# EAGLE design Nodo_actuador_wa4_v1 (EAGLE 8.5.1)

## Sheet 1 of 4: FUENTES
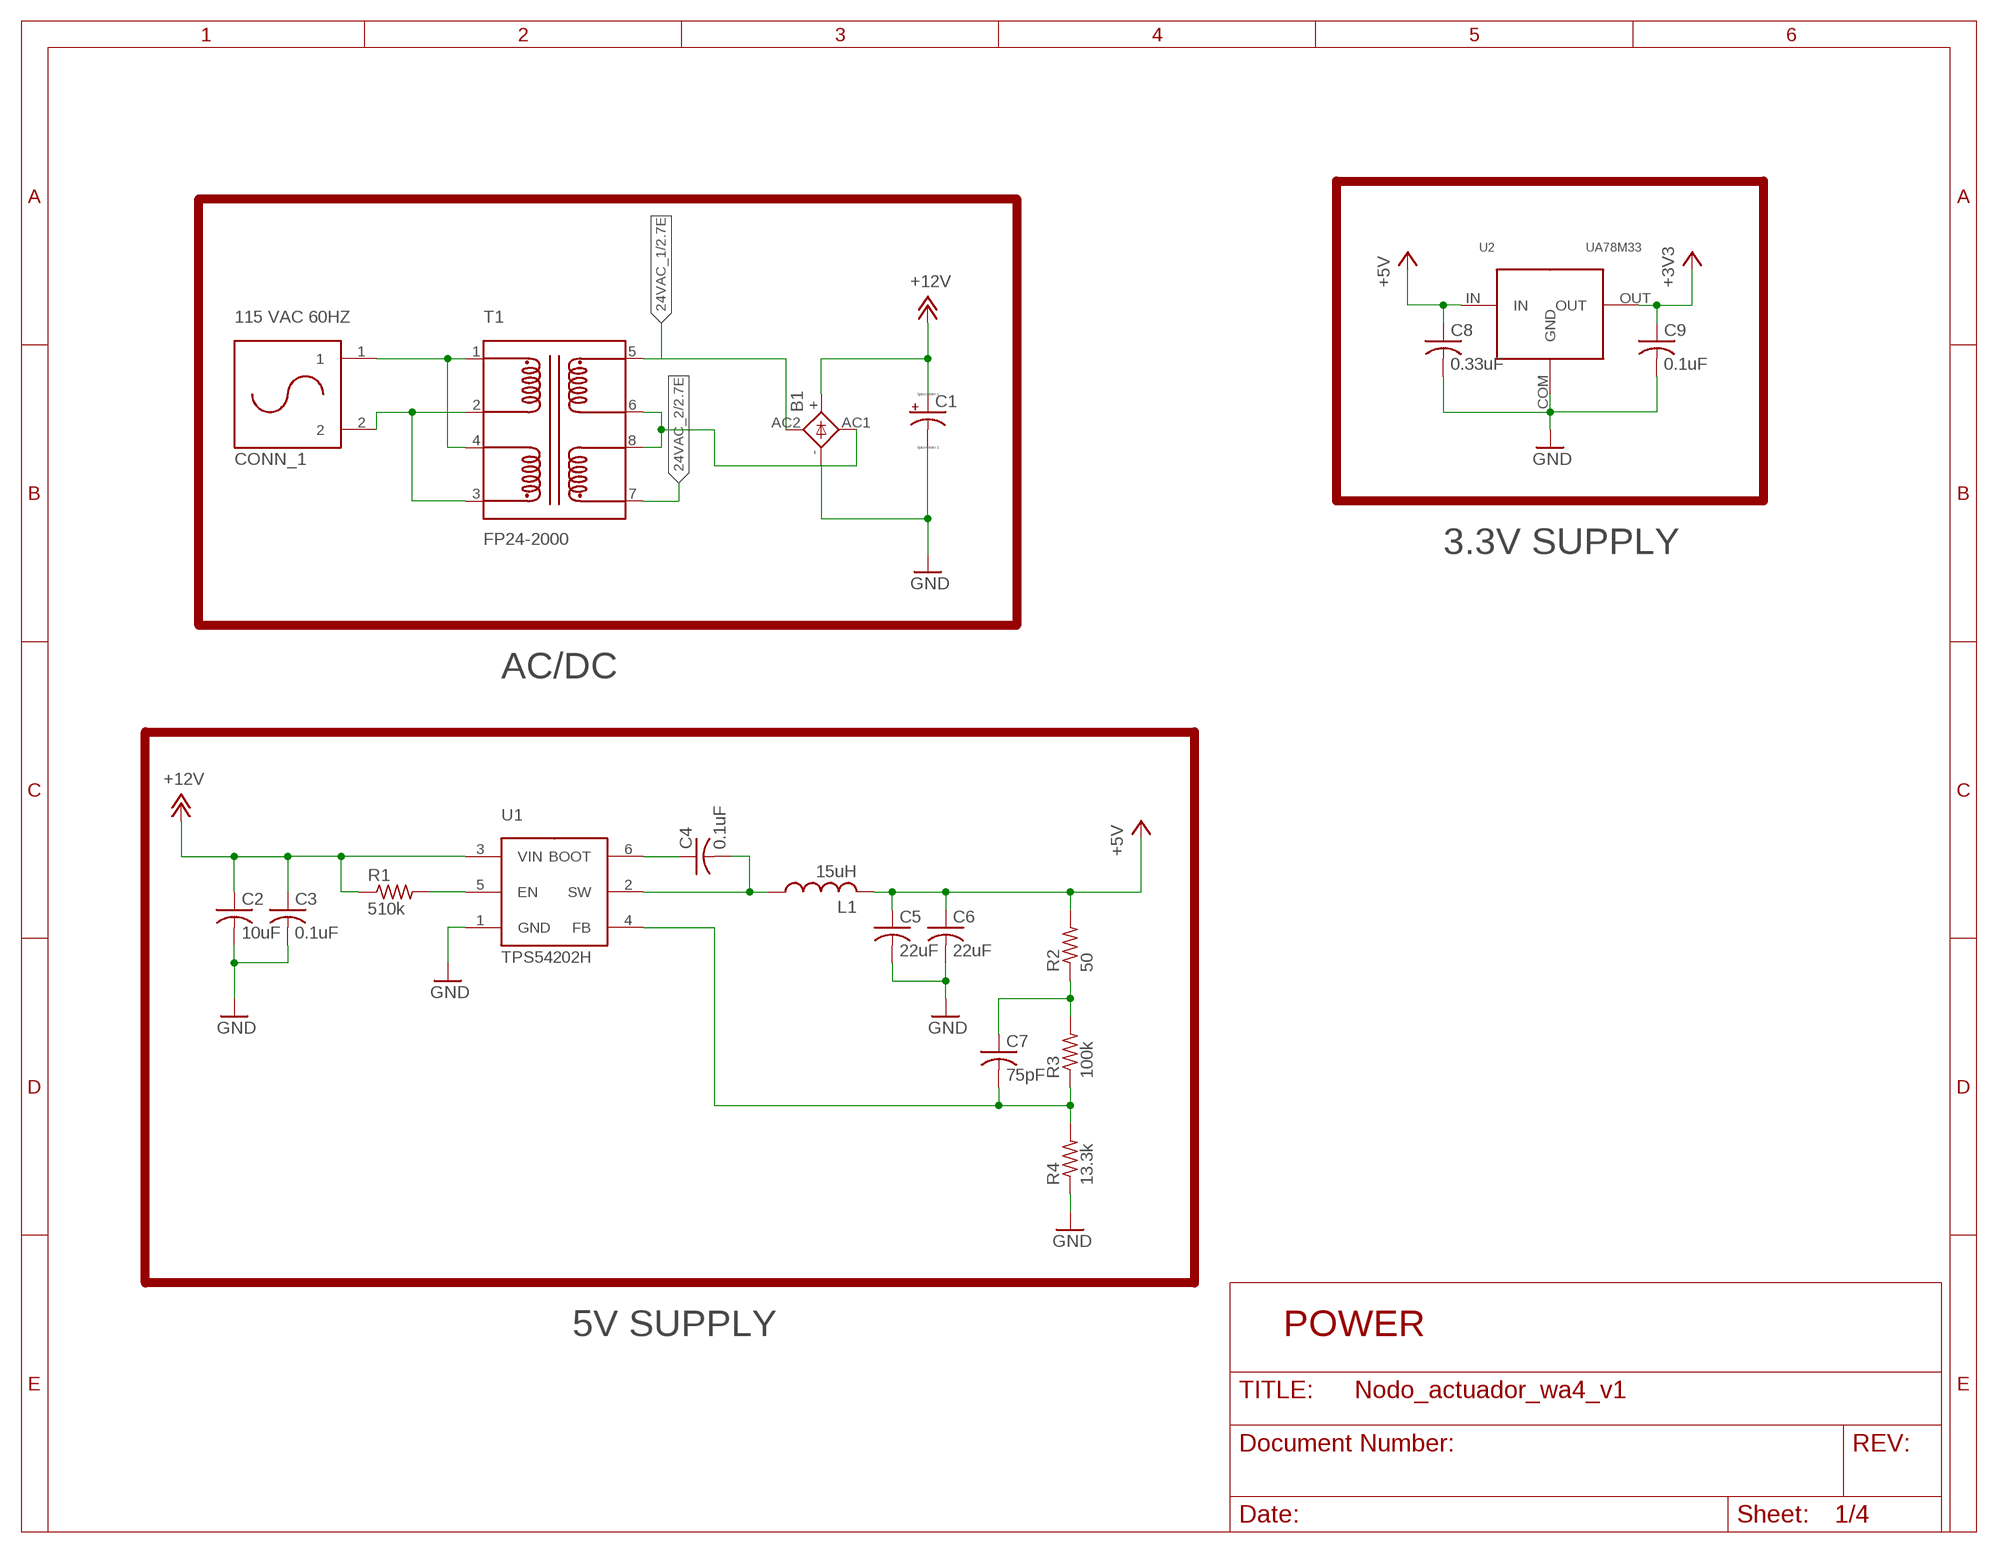
[diagram p0: schematic, sheet 1]

### Parts
B1  GBU4  [GBU4S]
C1  CPOL-USE5-13  [E5-13]
C2  10uF  C-USC0805  [C0805]
C3  0.1uF  C-USC0805  [C0805]
C4  0.1uF  C-USC0805  [C0805]
C5  22uF  C-USC0805  [C0805]
C6  22uF  C-USC0805  [C0805]
C7  75pF  C-USC0805  [C0805]
C8  0.33uF  C-USC0805  [C0805]
C9  0.1uF  C-USC0805  [C0805]
CONN_1  115 VAC 60HZ  2570-2210  [2570-2210]
L1  15uH  VLS5045EX  [VLS5045]
R1  510k  R-US_R0805  [R0805]
R2  50  R-US_R0805  [R0805]
R3  100k  R-US_R0805  [R0805]
R4  13.3k  R-US_R0805  [R0805]
T1  FP24-2000  [FP24-2000]
U1  TPS54202H  [SOT-23-6]
U2  UA78M33  [UA78XX]

### Nets
24VAC_1: B1.AC2(AC1) T1.5 ; also sheet 2
24VAC_2: T1.7 ; also sheet 2
+3V3: C9.1 U2.OUT ; also sheet 2,3,4
+5V: C5.1 C6.1 C8.1 L1.2 R2.2 U2.IN ; also sheet 2,3
+12V: B1.+ C1.+ C2.1 C3.1 R1.1 U1.3(VIN) ; also sheet 4
GND: B1.- C1.- C2.2 C3.2 C5.2 C6.2 C8.2 C9.2 R4.1 U1.1(GND) U2.COM(GND) ; also sheet 2,3,4
N$1: CONN_1.1 T1.1 T1.4
N$2: CONN_1.2 T1.2 T1.3
N$3: B1.AC1(AC2) T1.6 T1.8
N$4: C4.1 U1.6(BOOT)
N$5: C4.2 L1.1 U1.2(SW)
N$6: R1.2 U1.5(EN)
N$8: C7.1 R2.1 R3.2
N$9: C7.2 R3.1 R4.2 U1.4(FB)

### Notes on the sheet
- 3.3V SUPPLY
- AC/DC
- 5V SUPPLY | POWER

## Sheet 2 of 4: VALVULAS Y BOTONERA
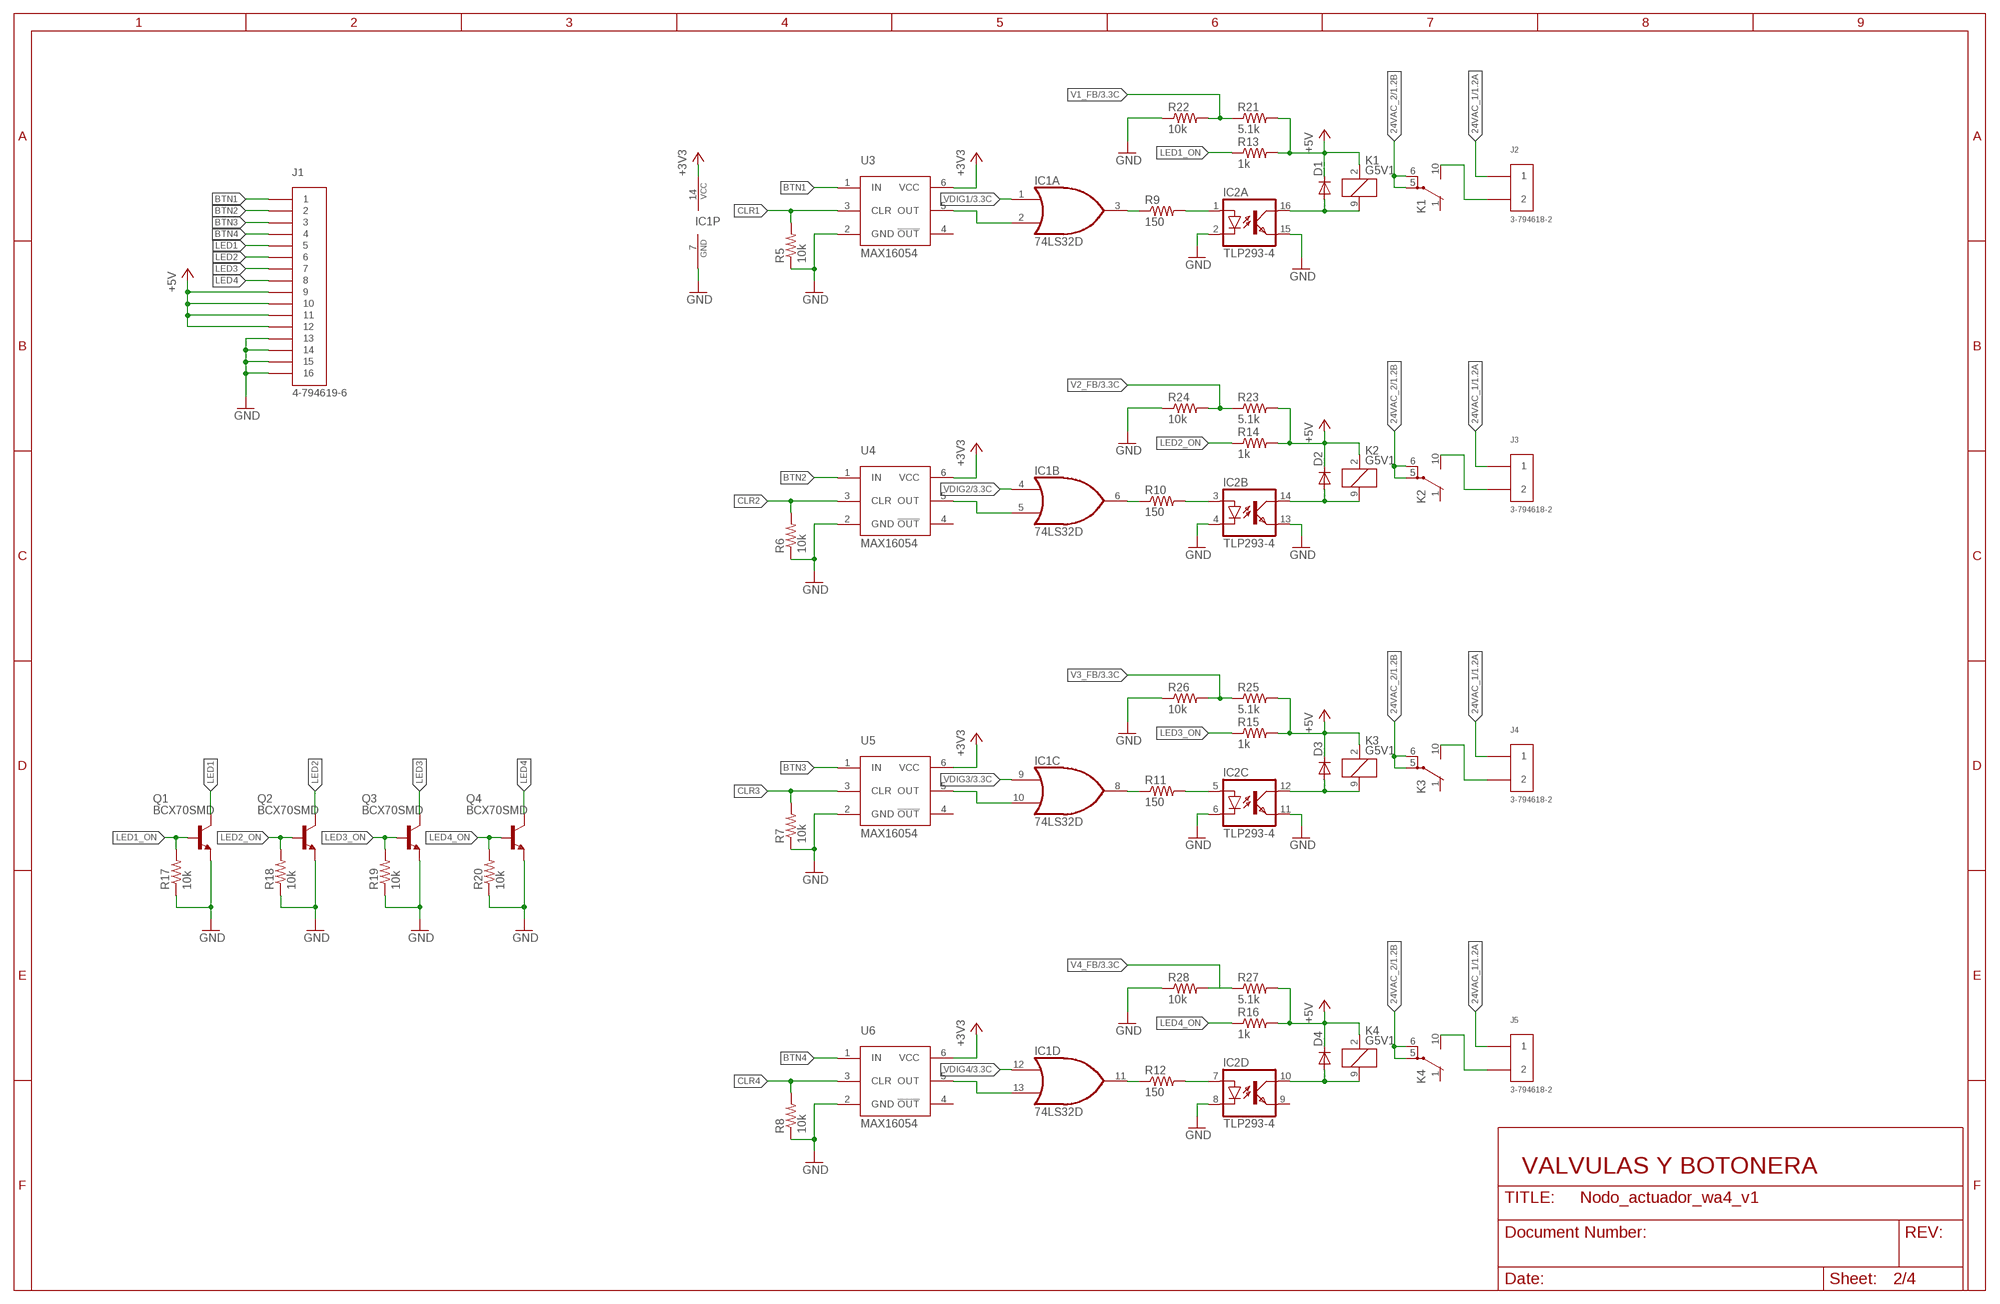
[diagram p1: schematic, sheet 2]

### Parts
D1  MBR0520LT  [SOD123]
D2  MBR0520LT  [SOD123]
D3  MBR0520LT  [SOD123]
D4  MBR0520LT  [SOD123]
IC1  74LS32D  [SO14]
IC2  TLP293-4  [SO16]
J1  4-794619-6  [4-794619-6]
J2  3-794618-2  [3-794618-2]
J3  3-794618-2  [3-794618-2]
J4  3-794618-2  [3-794618-2]
J5  3-794618-2  [3-794618-2]
K1  G5V1  [G5V1]
K2  G5V1  [G5V1]
K3  G5V1  [G5V1]
K4  G5V1  [G5V1]
Q1  BCX70SMD  [SOT23]
Q2  BCX70SMD  [SOT23]
Q3  BCX70SMD  [SOT23]
Q4  BCX70SMD  [SOT23]
R5  10k  R-US_R0805  [R0805]
R6  10k  R-US_R0805  [R0805]
R7  10k  R-US_R0805  [R0805]
R8  10k  R-US_R0805  [R0805]
R9  150  R-US_R0805  [R0805]
R10  150  R-US_R0805  [R0805]
R11  150  R-US_R0805  [R0805]
R12  150  R-US_R0805  [R0805]
R13  1k  R-US_R0805  [R0805]
R14  1k  R-US_R0805  [R0805]
R15  1k  R-US_R0805  [R0805]
R16  1k  R-US_R0805  [R0805]
R17  10k  R-US_R0805  [R0805]
R18  10k  R-US_R0805  [R0805]
R19  10k  R-US_R0805  [R0805]
R20  10k  R-US_R0805  [R0805]
R21  5.1k  R-US_R0805  [R0805]
R22  10k  R-US_R0805  [R0805]
R23  5.1k  R-US_R0805  [R0805]
R24  10k  R-US_R0805  [R0805]
R25  5.1k  R-US_R0805  [R0805]
R26  10k  R-US_R0805  [R0805]
R27  5.1k  R-US_R0805  [R0805]
R28  10k  R-US_R0805  [R0805]
U3  MAX16054  [SOT-23-6]
U4  MAX16054  [SOT-23-6]
U5  MAX16054  [SOT-23-6]
U6  MAX16054  [SOT-23-6]

### Nets
24VAC_1: J2.1 J3.1 J4.1 J5.1 ; also sheet 1
24VAC_2: K1.5(2:P) K1.6(2:P) K2.5(2:P) K2.6(2:P) K3.5(2:P) K3.6(2:P) K4.5(2:P) K4.6(2:P) ; also sheet 1
+3V3: IC1.14(P:VCC) U3.6(VCC) U4.6(VCC) U5.6(VCC) U6.6(VCC) ; also sheet 1,3,4
+5V: D1.C D2.C D3.C D4.C J1.5 J1.6 J1.7 J1.8 K1.2 K2.2 K3.2 K4.2 R13.2 R14.2 R15.2 R16.2 R21.2 R23.2 R25.2 R27.2 ; also sheet 1,3
BTN1: J1.16 U3.1(IN)
BTN2: J1.15 U4.1(IN)
BTN3: J1.14 U5.1(IN)
BTN4: J1.13 U6.1(IN)
CLR1: R5.2 U3.3(CLR)
CLR2: R6.2 U4.3(CLR)
CLR3: R7.2 U5.3(CLR)
CLR4: R8.2 U6.3(CLR)
GND: IC1.7(P:GND) IC2.2(A:C) IC2.4(B:C) IC2.6(C:C) IC2.8(D:C) IC2.11(C:EMIT) IC2.13(B:EMIT) IC2.15(A:EMIT) J1.1 J1.2 J1.3 J1.4 Q1.2(E) Q2.2(E) Q3.2(E) Q4.2(E) R5.1 R6.1 R7.1 R8.1 R17.1 R18.1 R19.1 R20.1 R22.1 R24.1 R26.1 R28.1 U3.2(GND) U4.2(GND) U5.2(GND) U6.2(GND) ; also sheet 1,3,4
LED1: D1.A IC2.16(A:COL) J1.12 K1.9 Q1.3(C)
LED1_ON: Q1.1(B) R13.1 R17.2 ; also sheet 3
LED2: J1.11 Q2.3(C)
LED2_ON: Q2.1(B) R14.1 R18.2
LED3: J1.10 Q3.3(C)
LED3_ON: Q3.1(B) R15.1 R19.2
LED4: J1.9 Q4.3(C)
LED4_ON: Q4.1(B) R16.1 R20.2
N$7: IC1.2(A:I1) U3.5(OUT)
N$10: IC1.5(B:I1) U4.5(OUT)
N$11: IC1.10(C:I1) U5.5(OUT)
N$12: IC1.13(D:I1) U6.5(OUT)
N$13: IC1.3(A:O) R9.1
N$14: IC2.1(A:A) R9.2
N$15: IC1.6(B:O) R10.1
N$16: IC1.8(C:O) R11.1
N$17: IC1.11(D:O) R12.1
N$18: IC2.7(D:A) R12.2
N$19: IC2.5(C:A) R11.2
N$20: IC2.3(B:A) R10.2
N$21: D3.A IC2.12(C:COL) K3.9
N$22: D4.A IC2.10(D:COL) K4.9
N$23: D2.A IC2.14(B:COL) K2.9
N$24: J2.2 K1.10(2:S)
N$25: J3.2 K2.10(2:S)
N$26: J4.2 K3.10(2:S)
N$27: J5.2 K4.10(2:S)
V1_FB: R21.1 R22.2 ; also sheet 3
V2_FB: R23.1 R24.2 ; also sheet 3
V3_FB: R25.1 R26.2 ; also sheet 3
V4_FB: R27.1 R28.2 ; also sheet 3
VDIG1: IC1.1(A:I0) ; also sheet 3
VDIG2: IC1.4(B:I0) ; also sheet 3
VDIG3: IC1.9(C:I0) ; also sheet 3
VDIG4: IC1.12(D:I0) ; also sheet 3
Unconnected: IC2.9(D:EMIT) K1.1(2:O) K2.1(2:O) K3.1(2:O) K4.1(2:O) U3.4(!OUT) U4.4(!OUT) U5.4(!OUT) U6.4(!OUT)

### Notes on the sheet
- VALVULAS Y BOTONERA

## Sheet 3 of 4: ARDUINO Y COMUNICACION
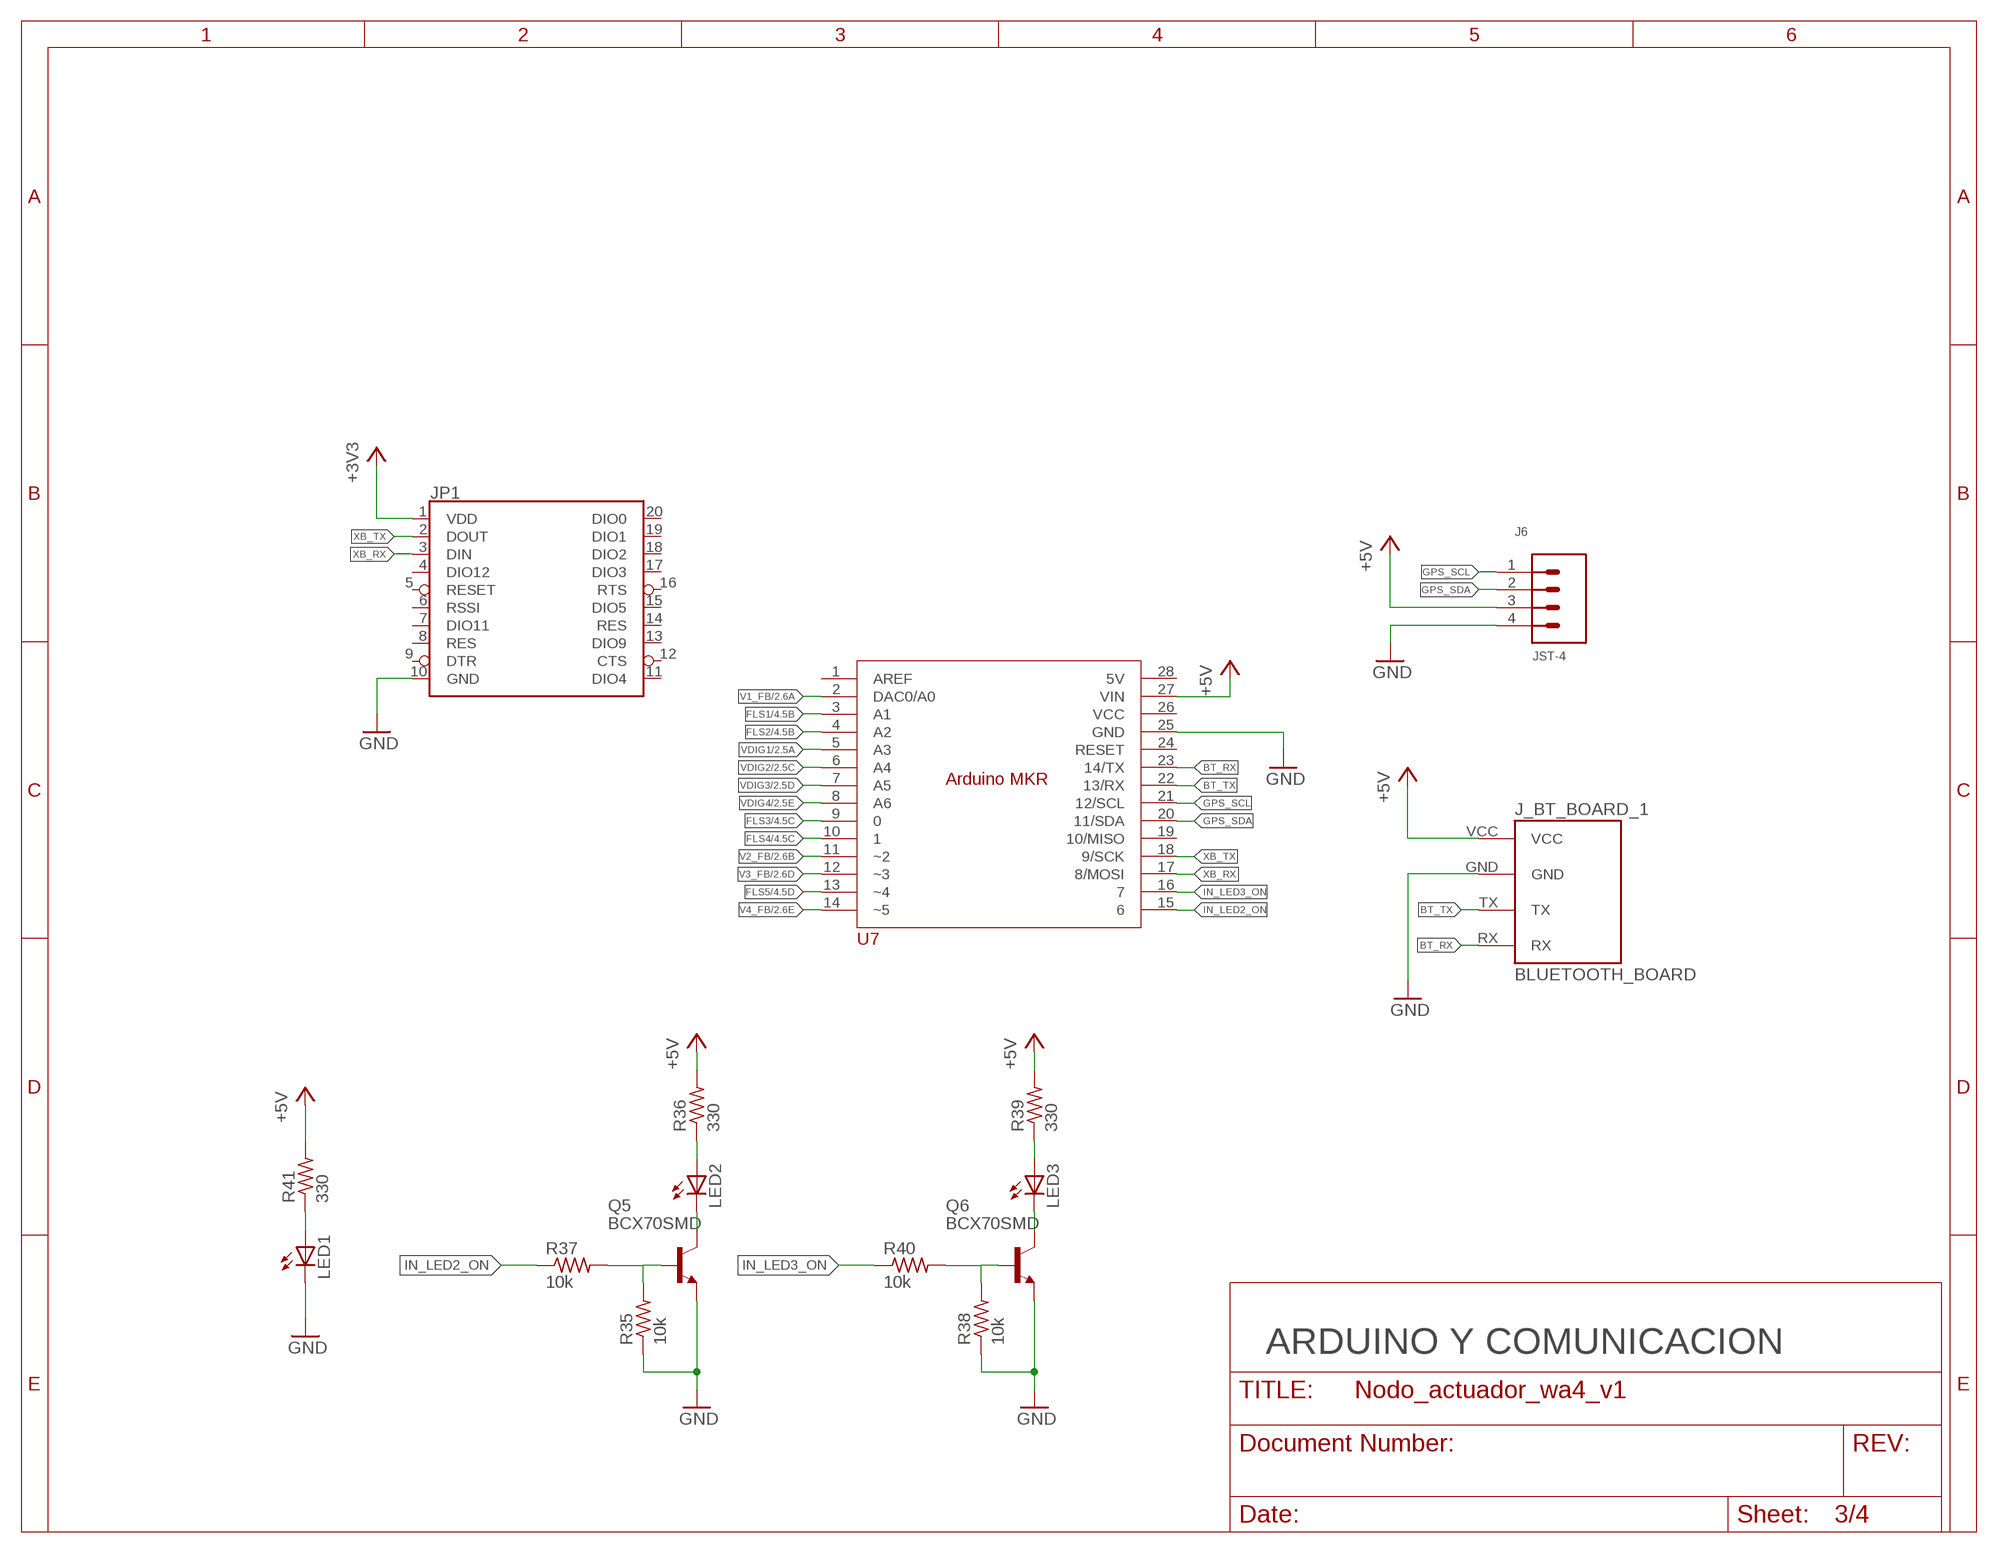
[diagram p2: schematic, sheet 3]

### Parts
J6  JST-4  [JST-4]
J_BT_BOARD_1  BLUETOOTH_BOARD  [BT_BOARD_FOOTPRINT]
JP1  XBEESILK  [XBEE-SILK]
LED1  LEDCHIP-LED0805  [CHIP-LED0805]
LED2  LEDCHIP-LED0805  [CHIP-LED0805]
LED3  LEDCHIP-LED0805  [CHIP-LED0805]
Q5  BCX70SMD  [SOT23]
Q6  BCX70SMD  [SOT23]
R35  10k  R-US_R0805  [R0805]
R36  330  R-US_R0805  [R0805]
R37  10k  R-US_R0805  [R0805]
R38  10k  R-US_R0805  [R0805]
R39  330  R-US_R0805  [R0805]
R40  10k  R-US_R0805  [R0805]
R41  330  R-US_R0805  [R0805]
U7  ARDUINO_MKR  [ARDUINO_MKR]

### Nets
+3V3: JP1.1(VDD) ; also sheet 1,2,4
+5V: J6.3 J_BT_BOARD_1.VCC R36.2 R39.2 R41.2 U7.27(VIN) ; also sheet 1,2
BT_RX: J_BT_BOARD_1.RX U7.23(14/TX)
BT_TX: J_BT_BOARD_1.TX U7.22(13/RX)
FLS1: U7.3(A1) ; also sheet 4
FLS2: U7.4(A2) ; also sheet 4
FLS3: U7.9 ; also sheet 4
FLS4: U7.10 ; also sheet 4
FLS5: U7.13(~4) ; also sheet 4
GND: J6.4 J_BT_BOARD_1.GND JP1.10(GND) LED1.C Q5.2(E) Q6.2(E) R35.1 R38.1 U7.25(GND) ; also sheet 1,2,4
GPS_SCL: J6.1 U7.21(12/SCL)
GPS_SDA: J6.2 U7.20(11/SDA)
IN_LED2_ON: R37.1 U7.15
IN_LED3_ON: R40.1 U7.16
LED1_ON: Q5.1(B) R35.2 R37.2 ; also sheet 2
LED1_ON1: Q6.1(B) R38.2 R40.2
N$38: LED2.A R36.1
N$39: LED2.C Q5.3(C)
N$40: LED1.A R41.1
N$41: LED3.A R39.1
N$42: LED3.C Q6.3(C)
V1_FB: U7.2(DAC0/A0) ; also sheet 2
V2_FB: U7.11(~2) ; also sheet 2
V3_FB: U7.12(~3) ; also sheet 2
V4_FB: U7.14(~5) ; also sheet 2
VDIG1: U7.5(A3) ; also sheet 2
VDIG2: U7.6(A4) ; also sheet 2
VDIG3: U7.7(A5) ; also sheet 2
VDIG4: U7.8(A6) ; also sheet 2
XB_RX: JP1.3(DIN) U7.17(8/MOSI)
XB_TX: JP1.2(DOUT) U7.18(9/SCK)
Unconnected: JP1.4(DIO12) JP1.5(RESET) JP1.6(RSSI) JP1.7(DIO11) JP1.8(RES) JP1.9(DTR) JP1.11(DIO4) JP1.12(CTS) JP1.13(DIO9) JP1.14(RES) JP1.15(DIO5) JP1.16(RTS) JP1.17(DIO3) JP1.18(DIO2) JP1.19(DIO1) JP1.20(DIO0) U7.1(AREF) U7.19(10/MISO) U7.24(RESET) U7.26(VCC) U7.28(5V)

### Notes on the sheet
- ARDUINO Y COMUNICACION

## Sheet 4 of 4: SENSORES
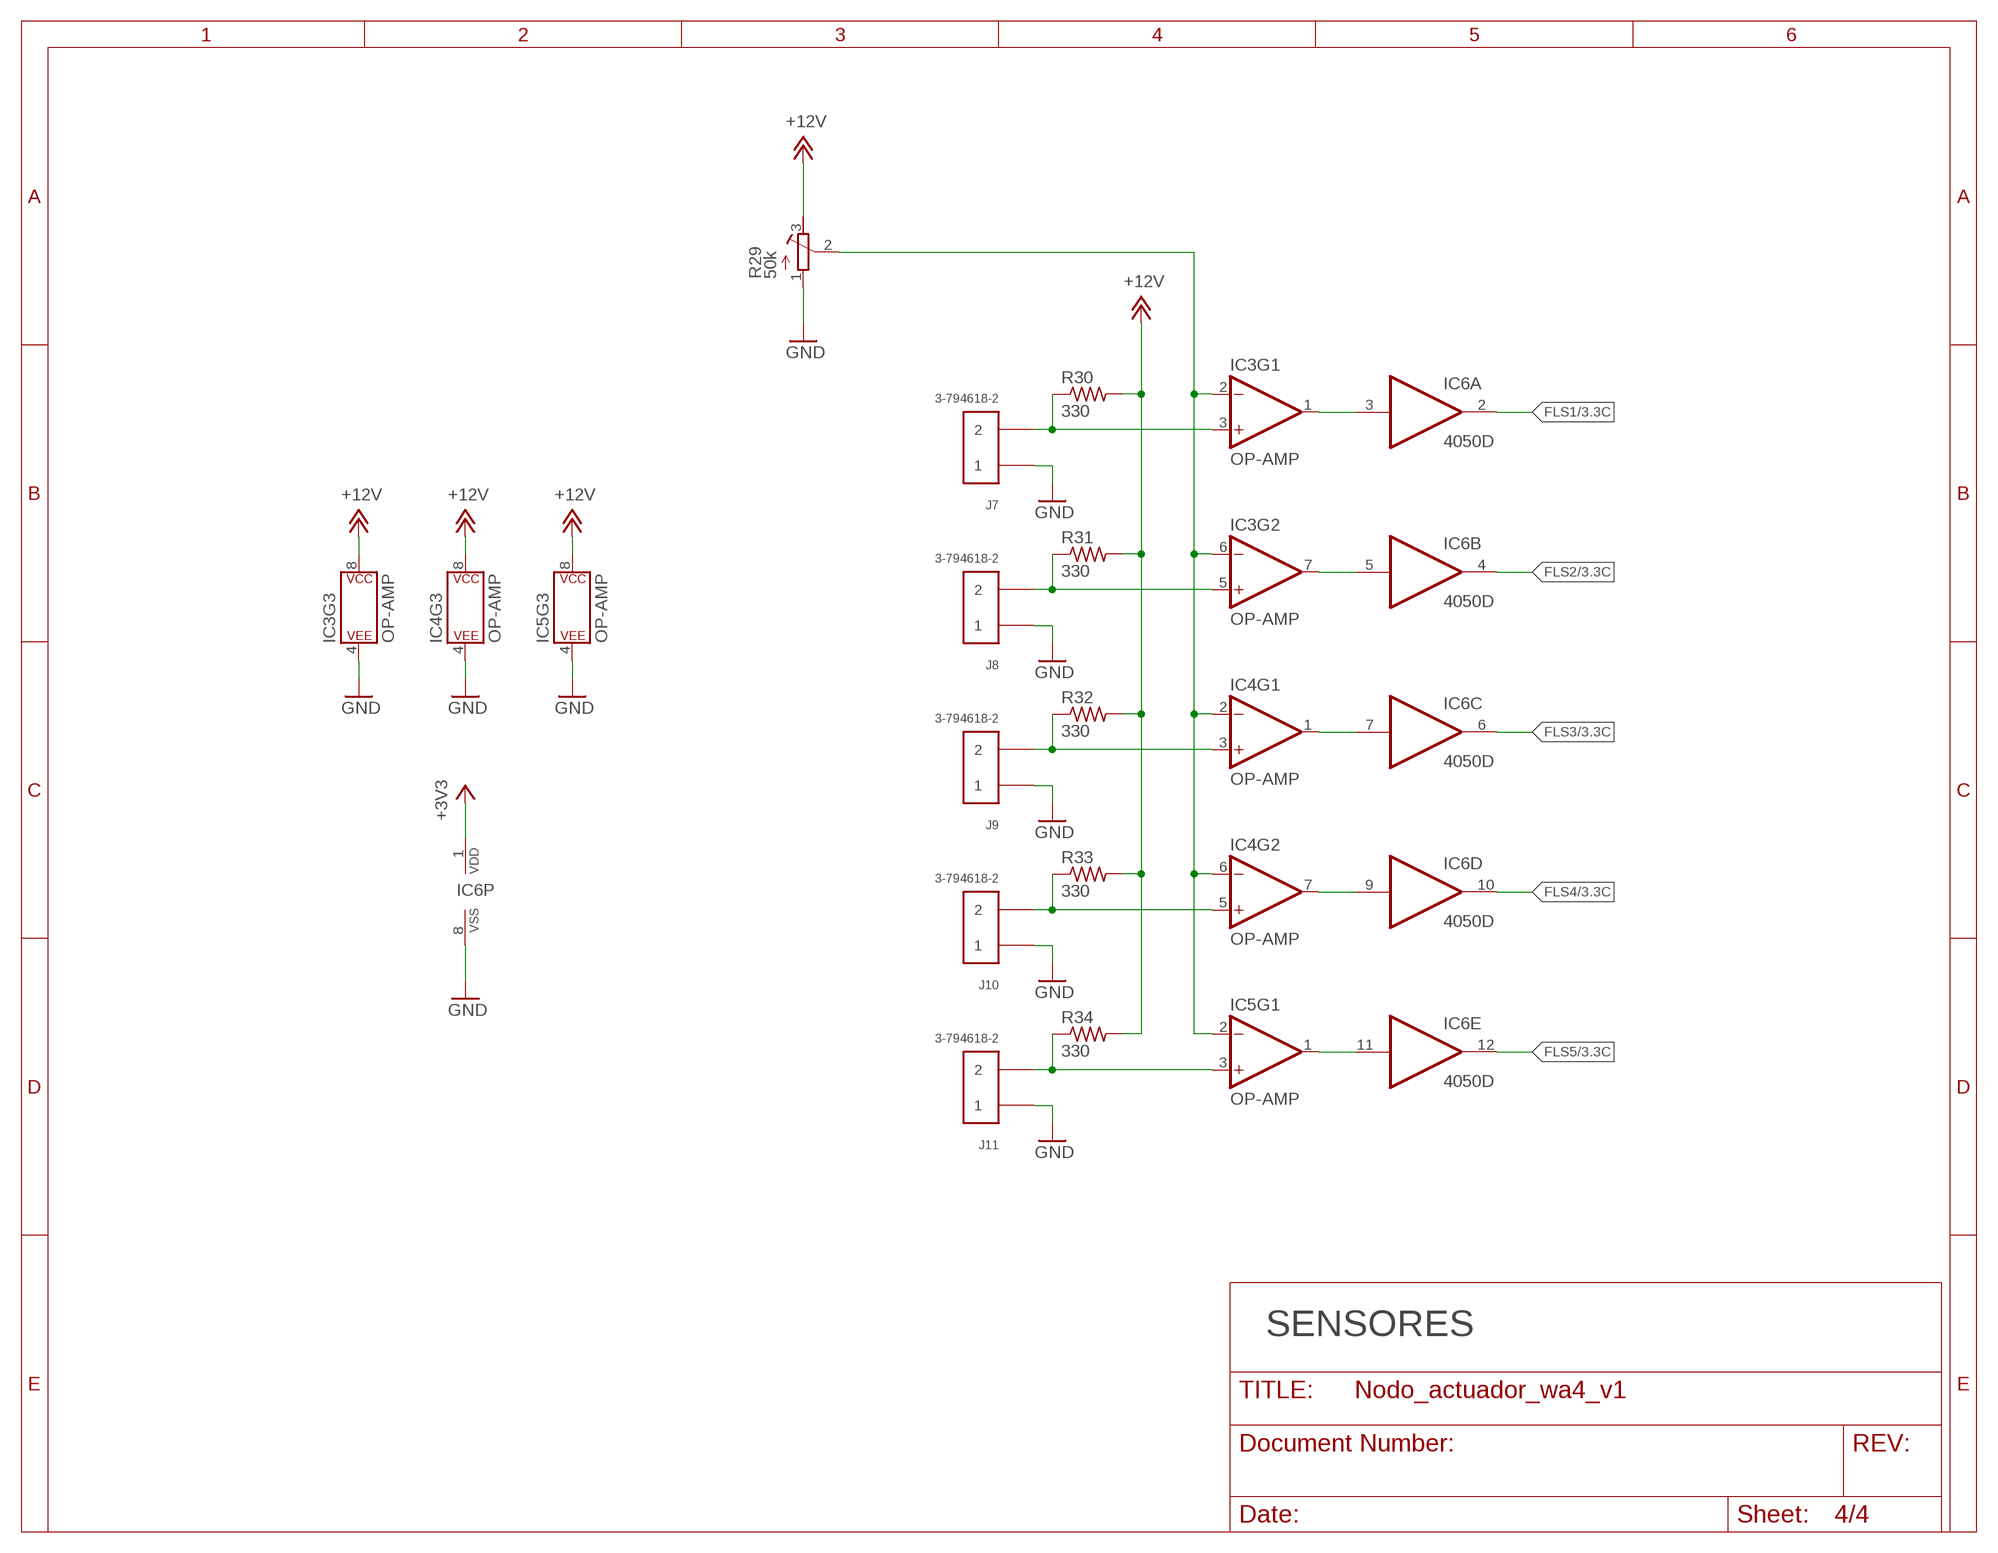
[diagram p3: schematic, sheet 4]

### Parts
IC3  OP-AMP  OPAMP-DUALU  [SO08]
IC4  OP-AMP  OPAMP-DUALU  [SO08]
IC5  OP-AMP  OPAMP-DUALU  [SO08]
IC6  4050D  [SO16]
J7  3-794618-2  [3-794618-2]
J8  3-794618-2  [3-794618-2]
J9  3-794618-2  [3-794618-2]
J10  3-794618-2  [3-794618-2]
J11  3-794618-2  [3-794618-2]
R29  50k  R-TRIMM3224W  [RTRIM3224W]
R30  330  R-US_R0805  [R0805]
R31  330  R-US_R0805  [R0805]
R32  330  R-US_R0805  [R0805]
R33  330  R-US_R0805  [R0805]
R34  330  R-US_R0805  [R0805]

### Nets
+3V3: IC6.1(P:VDD) ; also sheet 1,2,3
+12V: IC3.8(P$V+) IC4.8(P$V+) IC5.8(P$V+) R29.3(E) R30.2 R31.2 R32.2 R33.2 R34.2 ; also sheet 1
FLS1: IC6.2(A:O) ; also sheet 3
FLS2: IC6.4(B:O) ; also sheet 3
FLS3: IC6.6(C:O) ; also sheet 3
FLS4: IC6.10(D:O) ; also sheet 3
FLS5: IC6.12(E:O) ; also sheet 3
GND: IC3.4(P$V-) IC4.4(P$V-) IC5.4(P$V-) IC6.8(P:VSS) J7.1 J8.1 J9.1 J10.1 J11.1 R29.1(A) ; also sheet 1,2,3
N$28: IC3.3(+IN) J7.2 R30.1
N$29: IC3.5(+IN) J8.2 R31.1
N$30: IC4.3(+IN) J9.2 R32.1
N$31: IC4.5(+IN) J10.2 R33.1
N$32: IC5.3(+IN) J11.2 R34.1
N$33: IC3.1(OUT) IC6.3(A:I)
N$34: IC3.7(OUT) IC6.5(B:I)
N$35: IC4.1(OUT) IC6.7(C:I)
N$36: IC4.7(OUT) IC6.9(D:I)
N$37: IC5.1(OUT) IC6.11(E:I)
SENSOR_VREF: IC3.2(-IN) IC3.6(-IN) IC4.2(-IN) IC4.6(-IN) IC5.2(-IN) R29.2(S)
Unconnected: IC5.5(+IN) IC5.6(-IN) IC5.7(OUT) IC6.14(F:I) IC6.15(F:O)

### Notes on the sheet
- SENSORES

## Library data of the parts
B1 = rectifier:GBU4: GENERAL INSTRUMENT RECTIFIER
C1 = resistor:CPOL-US: POLARIZED CAPACITOR, American symbol
C2-C9 = resistor:C-US: CAPACITOR, American symbol
CONN_1 = actuador:2570-2210
D1-D4 = diode:MBR0520LT: SCHOTTKY BARRIER RECTIFIER Source: http://onsemi.com .. MBR0520LT1-D.pdf
IC1 = 74xx-us:74*32: Quad 2-input OR gate
IC2 = actuador:TLP293-4
IC3-IC5 = SparkFun-IC-Amplifiers:OPAMP-DUAL: Generic op-amp footprint This component is for the standard 358 pinning of a dual op-amp From the LM358 datasheet: Pin 1: Output A Pin 2: Inverting Input A Pin 3: Non-Inverting Input A Pin 4: Gnd Pin 5: Non-Inverting Input B Pin 6: Inverting Input B Pin 7: Output B Pin 8: V+; PROD_ID: NA-XXXXX
IC6 = 40xx:4050: Hex non-inverting BUFFER
J1 = actuador:4-794619-6
J2-J5 J7-J11 = actuador:3-794618-2
J6 = actuador:JST-4
J_BT_BOARD_1 = Bluetooth HC-05:BLUETOOTH_BOARD: Bluetooth Board V1.05
JP1 = SparkFun-RF:XBEE: Digi XBee and XBee Pro XBees are tiny blue chips that can communicate wirelessly with each other. They can do simple things, like replacing a couple of wires in serial communication, which is nice when you want to make a remote for your paintball vehicle. SparkFun Products SparkFun XBee Buying Guide <https://www.sparkfun.com/pages/xbee_guide> SparkFun XBee Explorer USB <https://www.sparkfun.com/products/11812> (WRL-11812) Breakout Board for XBee Module <https://www.sparkfun.com/products/8276> (WRL-8276) SparkFun XBee Explorer Regulated <https://www.sparkfun.com/products/11373> (WRL-11373) SparkFun XBee Explorer Dongle <https://www.sparkfun.com/products/11697> (WRL-11697) SparkFun XBee Shield <https://www.sparkfun.com/products/12847> (WRL-12847) SparkFun XBee Explorer Serial <https://www.sparkfun.com/products/13225> (WRL-13225)
K1-K4 = relay:G5V1: RELAY 1 x switch, 0.5 A/125 V AC, 1 A/24 V DC , Omron; MPN: G5V-1-DC24; OC_FARNELL: 9949593; OC_NEWARK: 36M6377
L1 = actuador:VLS5045EX
LED1-LED3 = led:LED: LED OSRAM: - CHIPLED LG R971, LG N971, LY N971, LG Q971, LY Q971, LO R971, LY R971 LH N974, LH R974 LS Q976, LO Q976, LY Q976 LO Q996 - Hyper CHIPLED LW Q18S LB Q993, LB Q99A, LB R99A - SideLED LS A670, LO A670, LY A670, LG A670, LP A670 LB A673, LV A673, LT A673, LW A673 LH A674 LY A675 LS A676, LA A676, LO A676, LY A676, LW A676 LS A679, LY A679, LG A679 - Hyper Micro SIDELED® LS Y876, LA Y876, LO Y876, LY Y876 LT Y87S - SmartLED LW L88C, LW L88S LB L89C, LB L89S, LG L890 LS L89K, LO L89K, LY L89K LS L896, LA L896, LO L896, LY L896 - TOPLED LS T670, LO T670, LY T670, LG T670, LP T670 LSG T670, LSP T670, LSY T670, LOP T670, LYG T670 LG T671, LOG T671, LSG T671 LB T673, LV T673, LT T673, LW T673 LH T674 LS T676, LA T676, LO T676, LY T676, LB T676, LH T676, LSB T676, LW T676 LB T67C, LV T67C, LT T67C, LS T67K, LO T67K, LY T67K, LW E67C LS E67B, LA E67B, LO E67B, LY E67B, LB E67C, LV E67C, LT E67C LW T67C LS T679, LY T679, LG T679 LS T770, LO T770, LY T770, LG T770, LP T770 LB T773, LV T773, LT T773, LW T773 LH T774 LS E675, LA E675, LY E675, LS T675 LS T776, LA T776, LO T776, LY T776, LB T776 LHGB T686 LT T68C, LB T68C - Hyper Mini TOPLED® LB M676 - Mini TOPLED Santana® LG M470 LS M47K, LO M47K, LY M47K Source: http://www.osram.convergy.de LUXEON: - LUMILED® LXK2-PW12-R00, LXK2-PW12-S00, LXK2-PW14-U00, LXK2-PW14-V00 LXK2-PM12-R00, LXK2-PM12-S00, LXK2-PM14-U00 LXK2-PE12-Q00, LXK2-PE12-R00, LXK2-PE12-S00, LXK2-PE14-T00, LXK2-PE14-U00 LXK2-PB12-K00, LXK2-PB12-L00, LXK2-PB12-M00, LXK2-PB14-N00, LXK2-PB14-P00, LXK2-PB14-Q00 LXK2-PR12-L00, LXK2-PR12-M00, LXK2-PR14-Q00, LXK2-PR14-R00 LXK2-PD12-Q00, LXK2-PD12-R00, LXK2-PD12-S00 LXK2-PH12-R00, LXK2-PH12-S00 LXK2-PL12-P00, LXK2-PL12-Q00, LXK2-PL12-R00 Source: www.luxeon.com KINGBRIGHT: KA-3528ASYC Source: www.kingbright.com
Q1-Q6 = transistor-npn:BCX70*: NPN Transistor
R1-R28 R30-R41 = resistor:R-US_: RESISTOR, American symbol
R29 = resistor:R-TRIMM: Trimm resistor
T1 = actuador:FP24-2000
U1 = actuador:TPS54202H
U2 = actuador:UA78M33
U3-U6 = actuador:MAX16054
U7 = Arduino_MKR:ARDUINO_MKR

## Board
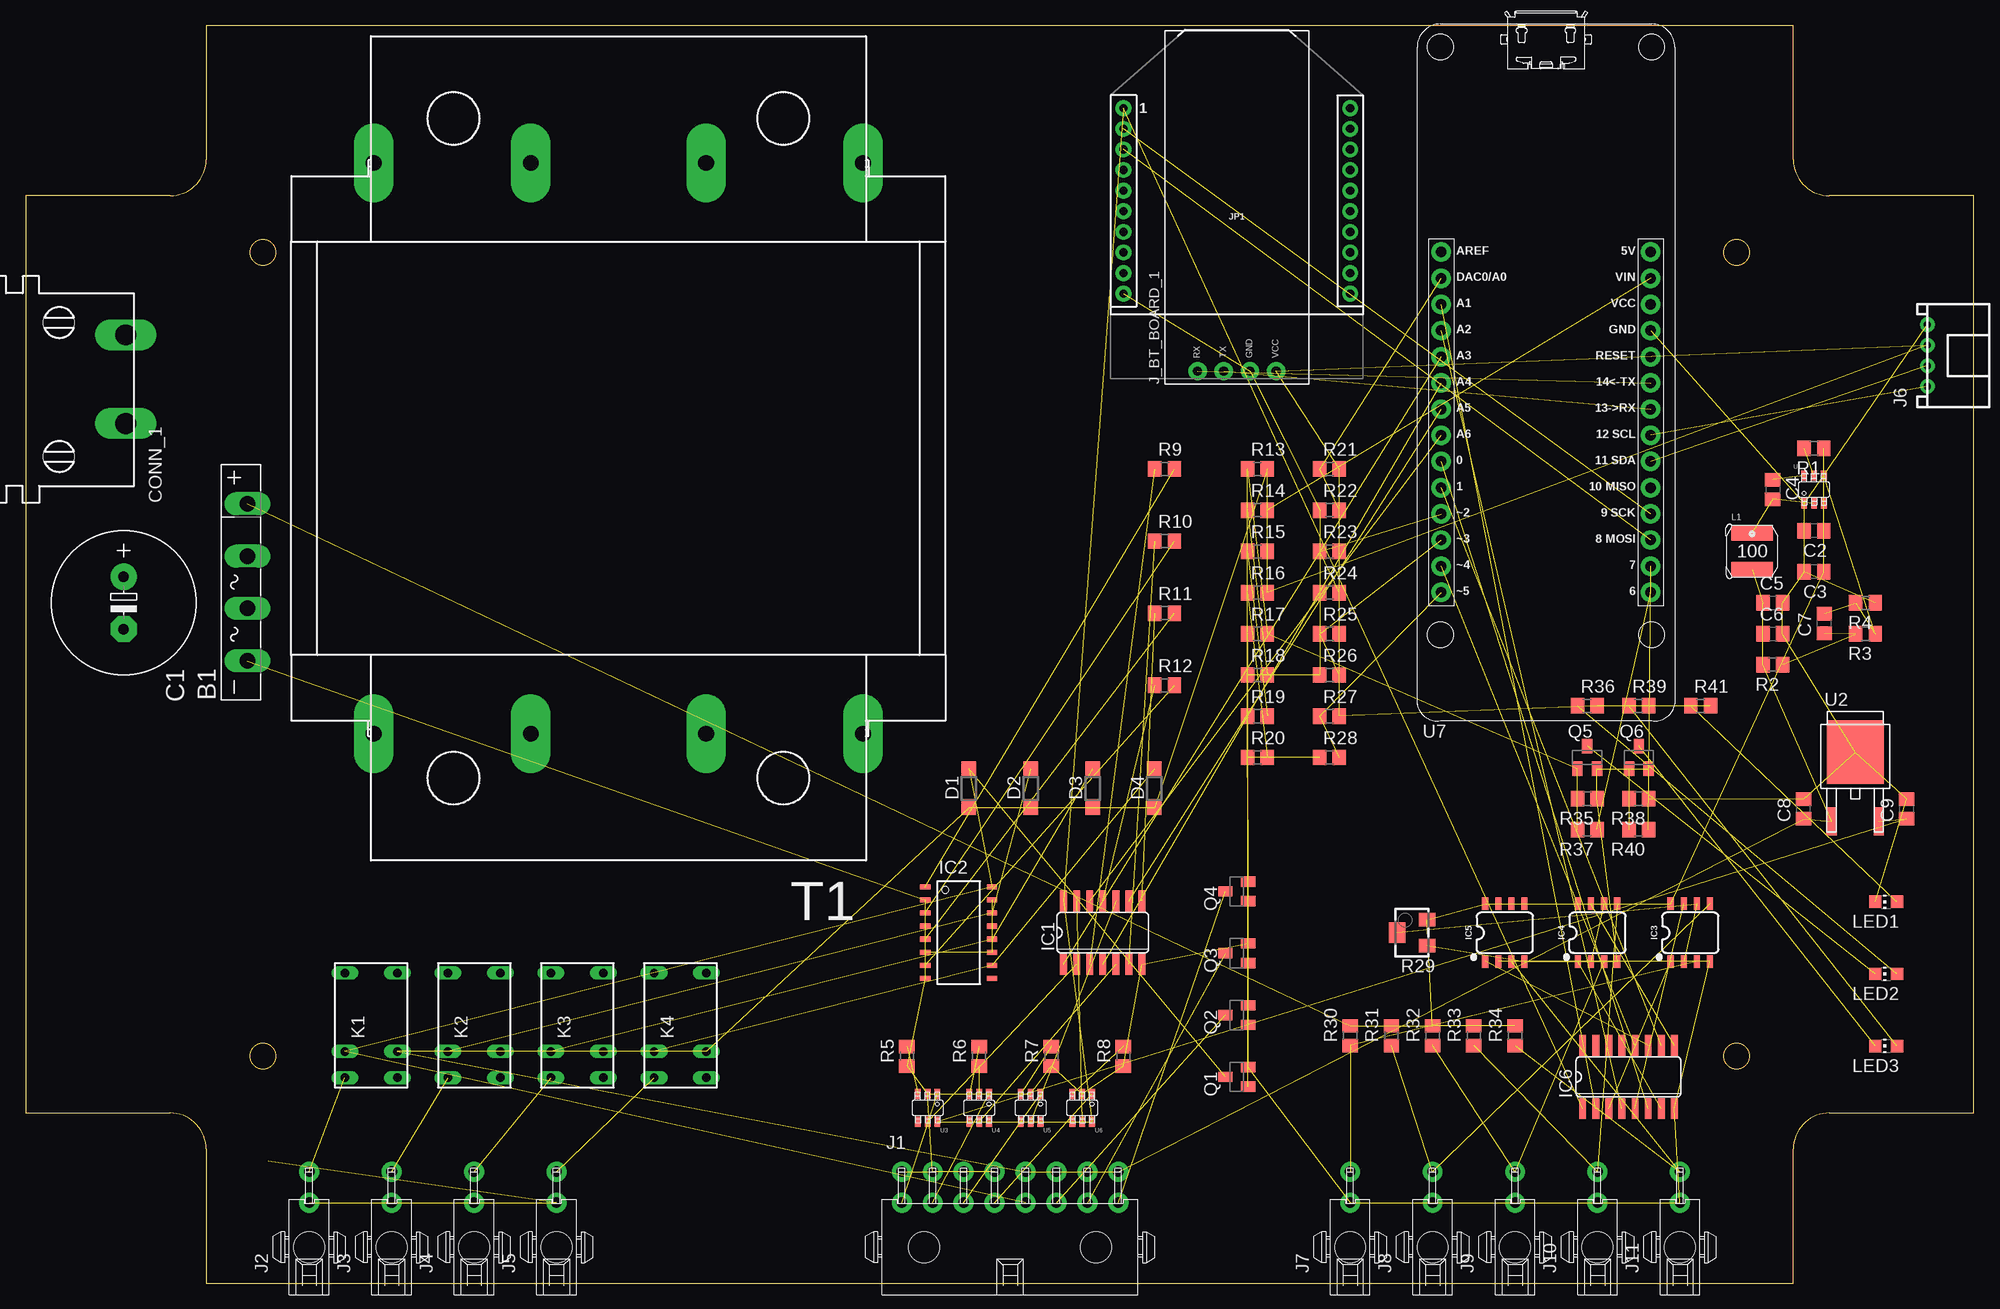
[diagram p4: board, top side]
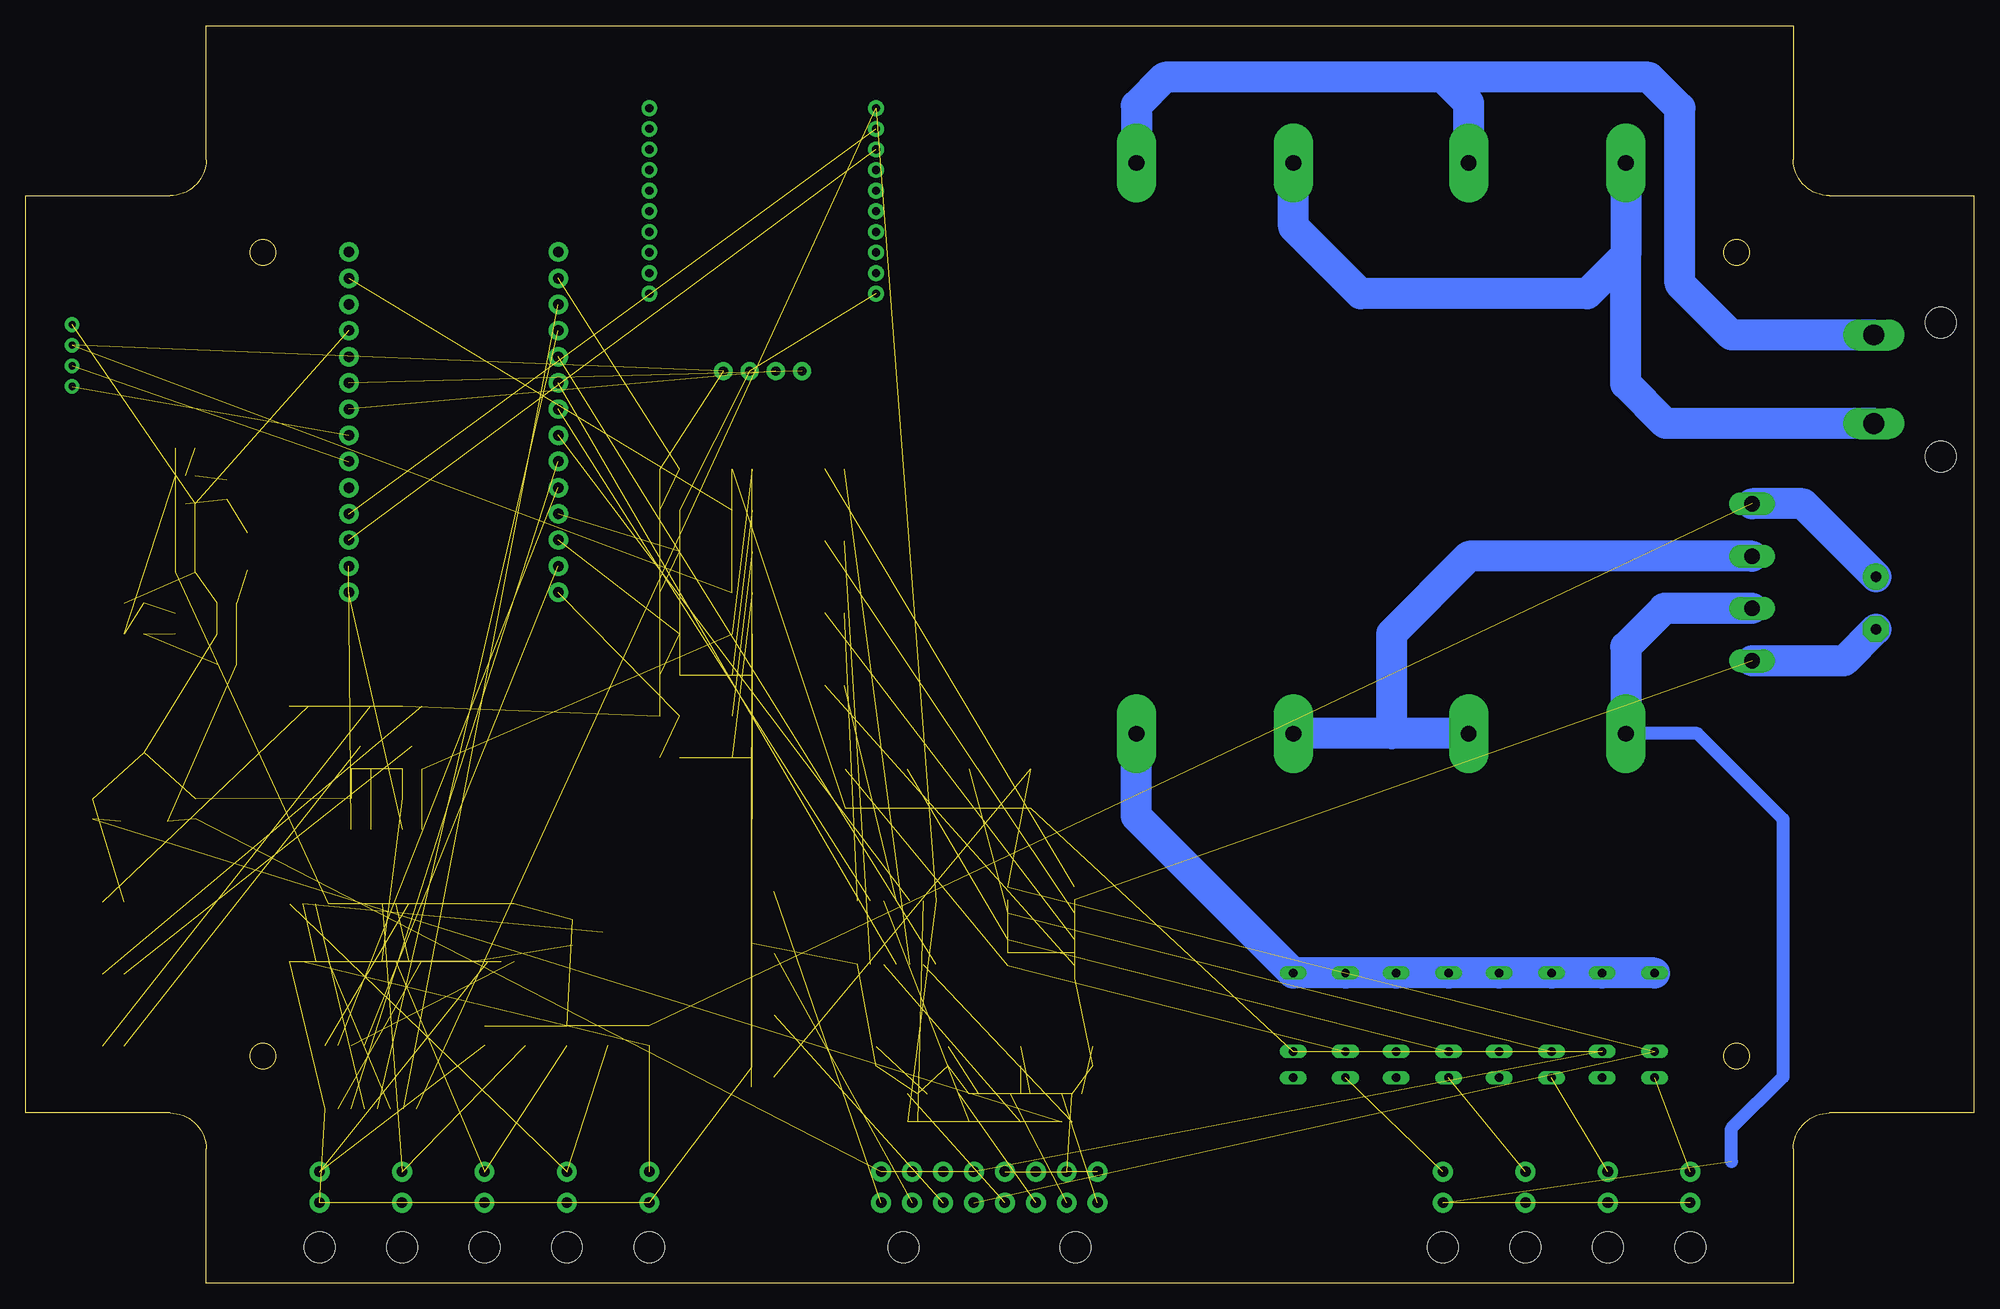
[diagram p5: board, bottom side, seen from below]

Size 189 x 122 mm. Coordinates in mm from the lower left corner, seen from the top.
Outline: 14,105.5 arc90 17.5,109 17.5,122 171.5,122 171.5,109 arc90 175,105.5 189,105.5 189,16.5 175,16.5 arc90 171.5,13 171.5,0 17.5,0 17.5,13 arc90 14,16.5 0,16.5 0,105.5 14,105.5
Outline: circle at 23,22 radius 1.25
Outline: circle at 166,100 radius 1.25
Outline: circle at 23,100 radius 1.25
Outline: circle at 166,22 radius 1.25
Copper layers (1*16): Top 0.035mm / dielectric 1.5mm / Bottom 0.035mm
Design rules "default": minimum track width 6mil, minimum drill 0.35mm, track to track 6mil, track to pad 6mil, pad to pad 6mil, via to via 6mil, smd to smd 6mil, copper to edge 40mil, drill to drill 6mil, minimum pad ring 10mil, minimum via ring 8mil, stop-mask expansion 4mil, vias tented up to drill 0mil, thermal gap 10mil

### Footprints (pad centres in the part's own frame; a part is rotated, then mirrored left to right if it is on the bottom)
GBU4S = drill 1.499 long: + 7.62,0; - -7.62,0; AC1 2.54,0; AC2 -2.54,0
E5-13 = drill 1.016 pad 2.54: + -2.54,0 | drill 1.016 pad 2.54 octagon: - 2.54,0
C0805 = smd 1.3 x 1.5: 1 -0.95,0; 2 0.95,0
2570-2210 = drill 2 pad 3 long: 1 -3.3,-6.5; 2 5.3,-6.5 | hole 3: -6.5,0; 6.5,0
SOD123 = smd 1.4 x 1.4: A 1.9,0; C -1.9,0
SO14 = smd 0.66 x 2.032: 1 -3.81,-3.073; 2 -2.54,-3.073; 3 -1.27,-3.073; 4 0,-3.073; 5 1.27,-3.073; 6 2.54,-3.073; 7 3.81,-3.073; 8 3.81,3.073; 9 2.54,3.073; 10 1.27,3.073; 11 0,3.073; 12 -1.27,3.073; 13 -2.54,3.073; 14 -3.81,3.073
SO16 = smd 1 x 0.5: 1 -3.24,4.445; 2 -3.24,3.175; 3 -3.24,1.905; 4 -3.24,0.635; 5 -3.24,-0.635; 6 -3.24,-1.905; 7 -3.24,-3.175; 8 -3.24,-4.445; 9 3.24,-4.445; 10 3.24,-3.175; 11 3.24,-1.905; 12 3.24,-0.635; 13 3.24,0.635; 14 3.24,1.905; 15 3.24,3.175; 16 3.24,4.445
SO08 = smd 0.6 x 1.2: 1 -1.905,-2.8; 2 -0.635,-2.8; 3 0.635,-2.8; 4 1.905,-2.8; 5 1.905,2.8; 6 0.635,2.8; 7 -0.635,2.8; 8 -1.905,2.8
SO16' = smd 0.66 x 2.032: 1 -4.445,-3.073; 2 -3.175,-3.073; 3 -1.905,-3.073; 4 -0.635,-3.073; 5 0.635,-3.073; 6 1.905,-3.073; 7 3.175,-3.073; 8 4.445,-3.073; 9 4.445,3.073; 10 3.175,3.073; 11 1.905,3.073; 12 0.635,3.073; 13 -0.635,3.073; 14 -1.905,3.073; 15 -3.175,3.073; 16 -4.445,3.073
4-794619-6 = drill 1.02 pad 1.93: 1 -10.5,5.8; 2 -7.5,5.8; 3 -4.5,5.8; 4 -1.5,5.8; 5 1.5,5.8; 6 4.5,5.8; 7 7.5,5.8; 8 10.5,5.8; 9 10.5,2.8; 10 7.5,2.8; 11 4.5,2.8; 12 1.5,2.8; 13 -1.5,2.8; 14 -4.5,2.8; 15 -7.5,2.8; 16 -10.5,2.8 | hole 3: 8.35,-1.52; -8.35,-1.52
3-794618-2 = drill 1.02 pad 1.93: 1 0,2.8; 2 0,5.8 | hole 3: 0,-1.52
JST-4 = drill 0.7 pad 1.422: 1 -3,0; 2 -1,0; 3 1,0; 4 3,0
BT_BOARD_FOOTPRINT = drill 0.9 pad 1.778: GND -16.51,-1.27; RX -16.51,3.81; TX -16.51,1.27; VCC -16.51,-3.81
XBEE-SILK = drill 0.8 pad 1.524: 1 -11,20; 2 -11,18; 3 -11,16; 4 -11,14; 5 -11,12; 6 -11,10; 7 -11,8; 8 -11,6; 9 -11,4; 10 -11,2; 11 11,2; 12 11,4; 13 11,6; 14 11,8; 15 11,10; 16 11,12; 17 11,14; 18 11,16; 19 11,18; 20 11,20
G5V1 = drill 0.813 long: 1 -5.08,-2.54; 2 -2.54,-2.54; 5 5.08,-2.54; 6 5.08,2.54; 9 -2.54,2.54; 10 -5.08,2.54
VLS5045 = smd 4 x 1.5: 1 0,1.8; 2 0,-1.8
CHIP-LED0805 = smd 1.2 x 1.2: A 0,-1.05; C 0,1.05
SOT23 = smd 1 x 1.4: 1 -0.95,-1.1; 2 0.95,-1.1; 3 0,1.1
R0805 = smd 1.3 x 1.5: 1 -0.95,0; 2 0.95,0
RTRIM3224W = smd 1.3 x 1.6: 1 -1.25,-1.45; 3 1.25,-1.45 | smd 2 x 1.6: 2 0,1.45
FP24-2000 = drill 1.524 pad 3.81 long: 1 23.736,-27.686; 2 8.496,-27.686; 3 -23.736,-27.686; 4 -8.496,-27.686; 5 23.736,27.686; 6 8.496,27.686; 7 -23.736,27.686; 8 -8.496,27.686
SOT-23-6 = smd 0.55 x 1: 1 -0.95,-1.35; 2 0,-1.35; 3 0.95,-1.35; 4 0.95,1.35; 5 0,1.35; 6 -0.95,1.35
UA78XX = smd 5.55 x 6.15: COM 0,2.5 | smd 1 x 2.72: IN -2.29,-4.2; OUT 2.29,-4.2
ARDUINO_MKR = drill 1.016 pad 1.88: 1 -10.16,11.04; 2 -10.16,8.5; 3 -10.16,5.96; 4 -10.16,3.42; 5 -10.16,0.88; 6 -10.16,-1.66; 7 -10.16,-4.2; 8 -10.16,-6.74; 9 -10.16,-9.28; 10 -10.16,-11.82; 11 -10.16,-14.36; 12 -10.16,-16.9; 13 -10.16,-19.44; 14 -10.16,-21.98; 15 10.16,-21.98; 16 10.16,-19.44; 17 10.16,-16.9; 18 10.16,-14.36; 19 10.16,-11.82; 20 10.16,-9.28; 21 10.16,-6.74; 22 10.16,-4.2; 23 10.16,-1.66; 24 10.16,0.88; 25 10.16,3.42; 26 10.16,5.96; 27 10.16,8.5; 28 10.16,11.04

### Placement (x,y rotation side)
B1  21.5,68 90 top
C1  9.5,66 270 top
C2  173.5,73 180 top
C3  173.5,69 180 top
C4  169.5,77 270 top
C5  169.5,66 0 top
C6  169.5,63 0 top
C7  174.5,64 90 top
C8  172.5,46 90 top
C9  182.5,46 90 top
CONN_1  3.2,86.7 90 top
D1  91.5,48 90 top
D2  97.5,48 90 top
D3  103.5,48 90 top
D4  109.5,48 90 top
IC1  104.5,34 0 top
IC2  90.5,34 0 top
IC3  161.5,34 0 top
IC4  152.5,34 0 top
IC5  143.5,34 0 top
IC6  4050D  [SO16']  155.5,20 0 top
J1  95.5,5 0 top
J2  27.5,5 0 top
J3  35.5,5 0 top
J4  43.5,5 0 top
J5  51.5,5 0 top
J6  184.5,90 90 top
J7  128.5,5 0 top
J8  136.5,5 0 top
J9  144.5,5 0 top
J10  152.5,5 0 top
J11  160.5,5 0 top
J_BT_BOARD_1  117.5,105 90 top
JP1  117.5,94 0 top
K1  33.5,25 90 top
K2  43.5,25 90 top
K3  53.5,25 90 top
K4  63.5,25 90 top
L1  167.5,71 0 top
LED1  180.5,37 90 top
LED2  180.5,30 90 top
LED3  180.5,23 90 top
Q1  117.5,20 90 top
Q2  117.5,26 90 top
Q3  117.5,32 90 top
Q4  117.5,38 90 top
Q5  151.5,51 0 top
Q6  156.5,51 0 top
R1  173.5,81 180 top
R2  169.5,60 180 top
R3  178.5,63 180 top
R4  178.5,66 180 top
R5  85.5,22 90 top
R6  92.5,22 90 top
R7  99.5,22 90 top
R8  106.5,22 90 top
R9  110.5,79 0 top
R10  110.5,72 0 top
R11  110.5,65 0 top
R12  110.5,58 0 top
R13  119.5,79 0 top
R14  119.5,75 0 top
R15  119.5,71 0 top
R16  119.5,67 0 top
R17  119.5,63 0 top
R18  119.5,59 0 top
R19  119.5,55 0 top
R20  119.5,51 0 top
R21  126.5,79 0 top
R22  126.5,75 0 top
R23  126.5,71 0 top
R24  126.5,67 0 top
R25  126.5,63 0 top
R26  126.5,59 0 top
R27  126.5,55 0 top
R28  126.5,51 0 top
R29  134.5,34 90 top
R30  128.5,24 90 top
R31  132.5,24 90 top
R32  136.5,24 90 top
R33  140.5,24 90 top
R34  144.5,24 90 top
R35  151.5,47 180 top
R36  151.5,56 0 top
R37  151.5,44 180 top
R38  156.5,47 180 top
R39  156.5,56 0 top
R40  156.5,44 180 top
R41  162.5,56 0 top
T1  57.5,81 180 top
U1  173.5,77 0 top
U2  177.5,49 0 top
U3  87.5,17 180 top
U4  92.5,17 180 top
U5  97.5,17 180 top
U6  102.5,17 180 top
U7  147.5,89 0 top

### Tracks (layer width: path | path; a pad name or v marks a point on that pad's centre or on a via)
24VAC_1  (4 unrouted)
  Bottom 1.27: 23.5,11.8 23.5,15 18.5,20 18.5,45 26.81,53.31 T1.5
  Bottom 3: B1.AC2 30.04,65.46 33.76,61.74 T1.5
24VAC_2
  Bottom 3: K1.6 K1.5 K2.6 K2.5 K3.6 K3.5 K4.6 K4.5 81.24,45.28 T1.7
+3V3  (8 unrouted)
+5V  (31 unrouted)
+12V  (13 unrouted)
  Bottom 3: C1.+ 16.58,75.62 B1.+
BT_RX  (1 unrouted)
BT_TX  (1 unrouted)
BTN1  (1 unrouted)
BTN2  (1 unrouted)
BTN3  (1 unrouted)
BTN4  (1 unrouted)
CLR1  (1 unrouted)
CLR2  (1 unrouted)
CLR3  (1 unrouted)
CLR4  (1 unrouted)
FLS1  (1 unrouted)
FLS2  (1 unrouted)
FLS3  (1 unrouted)
FLS4  (1 unrouted)
FLS5  (1 unrouted)
GND  (60 unrouted)
  Bottom 3: C1.- 12.58,60.38 B1.-
GPS_SCL  (1 unrouted)
GPS_SDA  (1 unrouted)
IN_LED2_ON  (1 unrouted)
IN_LED3_ON  (1 unrouted)
LED1  (4 unrouted)
LED1_ON  (5 unrouted)
LED1_ON1  (2 unrouted)
LED2  (1 unrouted)
LED2_ON  (2 unrouted)
LED3  (1 unrouted)
LED3_ON  (2 unrouted)
LED4  (1 unrouted)
LED4_ON  (2 unrouted)
N$1
  Bottom 3: T1.1 33.76,99.74 | 33.76,99.74 37.5,96 59.5,96 66,102.5 T1.4 | CONN_1.1 29.9,83.4 33.76,87.26 33.76,99.74
N$2
  Bottom 3: T1.2 49,114.5 51.5,117 | 51.5,117 78.5,117 81.24,114.26 T1.3 | 51.5,117 31.5,117 28.5,114 28.5,97 23.5,92 CONN_1.2
N$3
  Bottom 3: T1.6 56.5,53.31 | 56.5,53.31 T1.8 | 56.5,53.31 56.5,63 48.96,70.54 B1.AC1
N$4  (1 unrouted)
N$5  (2 unrouted)
N$6  (1 unrouted)
N$7  (1 unrouted)
N$8  (2 unrouted)
N$9  (3 unrouted)
N$10  (1 unrouted)
N$11  (1 unrouted)
N$12  (1 unrouted)
N$13  (1 unrouted)
N$14  (1 unrouted)
N$15  (1 unrouted)
N$16  (1 unrouted)
N$17  (1 unrouted)
N$18  (1 unrouted)
N$19  (1 unrouted)
N$20  (1 unrouted)
N$21  (2 unrouted)
N$22  (2 unrouted)
N$23  (2 unrouted)
N$24  (1 unrouted)
N$25  (1 unrouted)
N$26  (1 unrouted)
N$27  (1 unrouted)
N$28  (2 unrouted)
N$29  (2 unrouted)
N$30  (2 unrouted)
N$31  (2 unrouted)
N$32  (2 unrouted)
N$33  (1 unrouted)
N$34  (1 unrouted)
N$35  (1 unrouted)
N$36  (1 unrouted)
N$37  (1 unrouted)
N$38  (1 unrouted)
N$39  (1 unrouted)
N$40  (1 unrouted)
N$41  (1 unrouted)
N$42  (1 unrouted)
SENSOR_VREF  (5 unrouted)
V1_FB  (2 unrouted)
V2_FB  (2 unrouted)
V3_FB  (2 unrouted)
V4_FB  (2 unrouted)
VDIG1  (1 unrouted)
VDIG2  (1 unrouted)
VDIG3  (1 unrouted)
VDIG4  (1 unrouted)
XB_RX  (1 unrouted)
XB_TX  (1 unrouted)